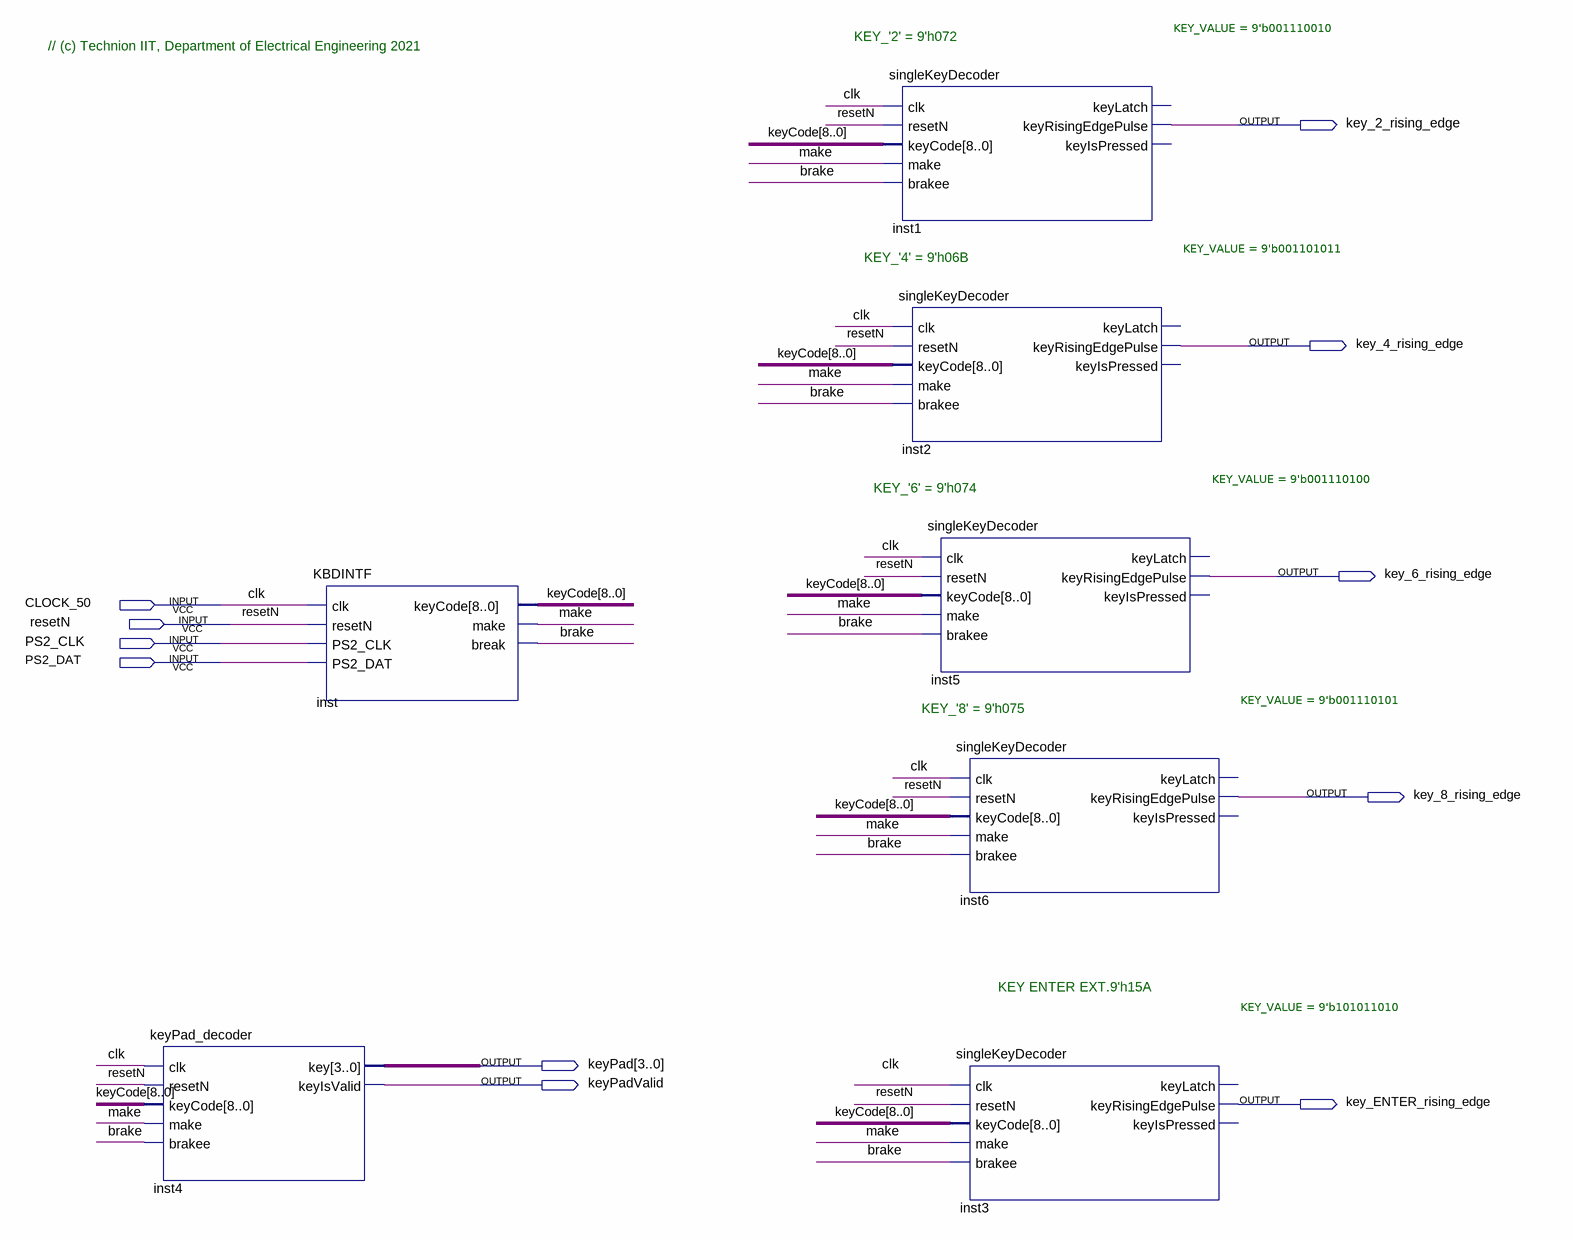
[diagram p0: schematic sheet]
// Quartus schematic KEYBOARD_DECODER.bdf as structural Verilog: 7 symbols, 11 pins
module KEYBOARD_DECODER (
  input  CLOCK_50,
  input  resetN,
  input  PS2_CLK,
  input  PS2_DAT,
  output key_2_rising_edge,
  output key_4_rising_edge,
  output key_6_rising_edge,
  output key_8_rising_edge,
  output [3:0] keyPad,
  output keyPadValid,
  output key_ENTER_rising_edge
);

  wire brake, make;
  wire [8:0] keyCode;

  keyPad_decoder inst4 (
    .clk(CLOCK_50), .resetN(resetN), .keyCode(keyCode), .make(make), .brakee(brake), .key(keyPad),
    .keyIsValid(keyPadValid));
  KBDINTF inst (
    .clk(CLOCK_50), .resetN(resetN), .PS2_CLK(PS2_CLK), .PS2_DAT(PS2_DAT), .keyCode(keyCode), .make(make),
    .\break (brake));
  singleKeyDecoder #(.KEY_VALUE(9'b001110010)) inst1 (
    .clk(CLOCK_50), .resetN(resetN), .keyCode(keyCode), .make(make), .brakee(brake),
    .keyRisingEdgePulse(key_2_rising_edge));  // open: keyLatch, keyIsPressed
  singleKeyDecoder #(.KEY_VALUE(9'b001101011)) inst2 (
    .clk(CLOCK_50), .resetN(resetN), .keyCode(keyCode), .make(make), .brakee(brake),
    .keyRisingEdgePulse(key_4_rising_edge));  // open: keyLatch, keyIsPressed
  singleKeyDecoder #(.KEY_VALUE(9'b001110100)) inst5 (
    .clk(CLOCK_50), .resetN(resetN), .keyCode(keyCode), .make(make), .brakee(brake),
    .keyRisingEdgePulse(key_6_rising_edge));  // open: keyLatch, keyIsPressed
  singleKeyDecoder #(.KEY_VALUE(9'b001110101)) inst6 (
    .clk(CLOCK_50), .resetN(resetN), .keyCode(keyCode), .make(make), .brakee(brake),
    .keyRisingEdgePulse(key_8_rising_edge));  // open: keyLatch, keyIsPressed
  singleKeyDecoder #(.KEY_VALUE(9'b101011010)) inst3 (
    .clk(CLOCK_50), .resetN(resetN), .keyCode(keyCode), .make(make), .brakee(brake),
    .keyRisingEdgePulse(key_ENTER_rising_edge));  // open: keyLatch, keyIsPressed

  // Other names for the same wires on the sheet: clk = CLOCK_50

  // Notes on the sheet:
  //   KEY_'2' = 9'h072
  //   // (c) Technion IIT, Department of Electrical Engineering 2021 
  //   KEY_'4' = 9'h06B
  //   KEY_'6' = 9'h074
  //   KEY_'8' = 9'h075
  //   KEY ENTER EXT.9'h15A
endmodule
